# Altium schematic sheet chess_top.SchDoc
size A4
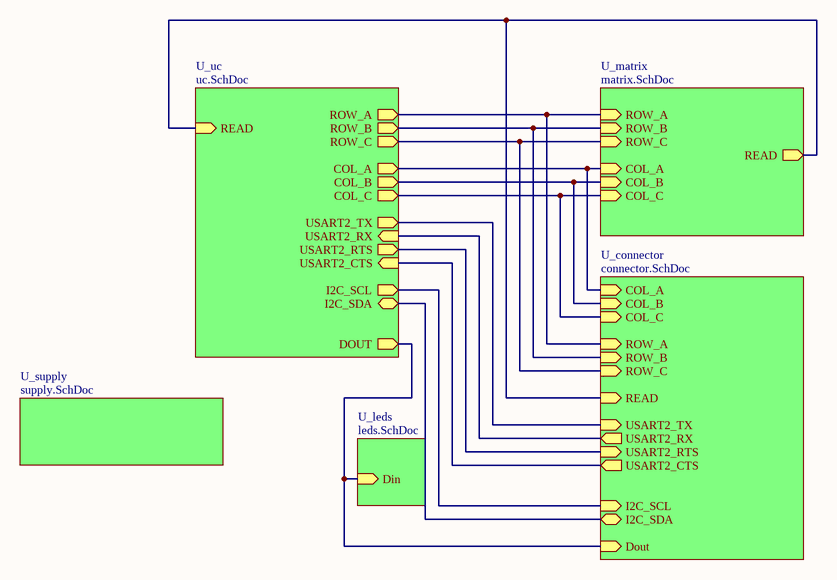
[diagram p0: chess_top.SchDoc]

## Sub-sheets
U_connector = connector.SchDoc: COL_C (in), COL_B (in), Dout (in), COL_A (in), ROW_B (in), USART2_RTS (in), USART2_RX (out), READ (in), USART2_TX (in), USART2_CTS (out), ROW_C (in), ROW_A (in), I2C_SDA (bidir), I2C_SCL (in)
U_leds = leds.SchDoc: Din (in)
U_matrix = matrix.SchDoc: COL_A (in), COL_B (in), ROW_B (in), COL_C (in), ROW_C (in), ROW_A (in), READ (out)
U_supply = supply.SchDoc: no entries
U_uc = uc.SchDoc: ROW_A (out), ROW_B (out), ROW_C (out), COL_A (out), COL_B (out), COL_C (out), READ (in), USART2_TX (out), USART2_RX (in), USART2_RTS (out), USART2_CTS (in), DOUT (out), I2C_SCL (out), I2C_SDA (bidir)

## Nets
(unnamed): sheet U_connector/COL_C, sheet U_matrix/COL_C, sheet U_uc/COL_C
(unnamed): sheet U_connector/COL_B, sheet U_matrix/COL_B, sheet U_uc/COL_B
(unnamed): sheet U_connector/Dout, sheet U_leds/Din, sheet U_uc/DOUT
(unnamed): sheet U_connector/COL_A, sheet U_matrix/COL_A, sheet U_uc/COL_A
(unnamed): sheet U_connector/ROW_B, sheet U_matrix/ROW_B, sheet U_uc/ROW_B
(unnamed): sheet U_connector/USART2_RTS, sheet U_uc/USART2_RTS
(unnamed): sheet U_connector/USART2_RX, sheet U_uc/USART2_RX
(unnamed): sheet U_connector/READ, sheet U_matrix/READ, sheet U_uc/READ
(unnamed): sheet U_connector/USART2_TX, sheet U_uc/USART2_TX
(unnamed): sheet U_connector/USART2_CTS, sheet U_uc/USART2_CTS
(unnamed): sheet U_connector/ROW_C, sheet U_matrix/ROW_C, sheet U_uc/ROW_C
(unnamed): sheet U_connector/ROW_A, sheet U_matrix/ROW_A, sheet U_uc/ROW_A
(unnamed): sheet U_connector/I2C_SDA, sheet U_uc/I2C_SDA
(unnamed): sheet U_connector/I2C_SCL, sheet U_uc/I2C_SCL